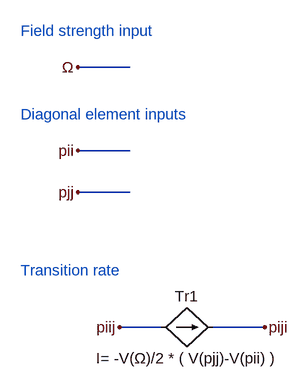
[diagram p0: schematic driven_rate_ofdiag.asc]
driven_rate_ofdiag.asc, the LTspice schematic file:
Version 4
SHEET 1 880 680
WIRE -64 -96 -144 -96
WIRE -64 32 -144 32
WIRE -64 96 -144 96
WIRE -16 304 -80 304
WIRE 144 304 64 304
FLAG -144 -96 Ω
FLAG -80 304 piij
FLAG 144 304 piji
FLAG -144 32 pii
FLAG -144 96 pjj
SYMBOL bi -16 304 R270
WINDOW 0 32 40 VTop 2
WINDOW 3 -32 40 VBottom 2
SYMATTR InstName Tr1
SYMATTR Value I= -V(Ω)/2 * ( V(pjj)-V(pii) )
TEXT -232 -24 Left 2 ;Diagonal element inputs
TEXT -232 -152 Left 2 ;Field strength input
TEXT -232 216 Left 2 ;Transition rate

The netlist it stands for:
* driven_rate_ofdiag.asc
B§Tr1 piij piji I= -V(Ω)/2 * ( V(pjj)-V(pii) )
* Diagonal element inputs
* Field strength input
* Transition rate
.backanno
.end